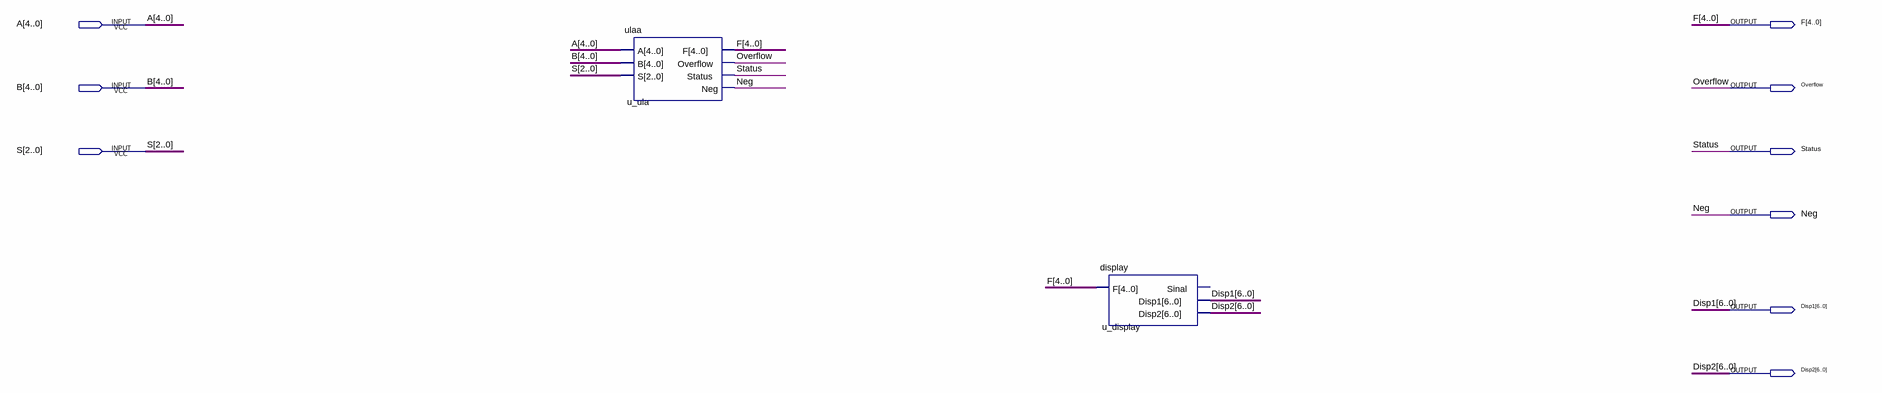
[diagram p0: schematic sheet]
// Quartus schematic ula_display.bdf as structural Verilog: 2 symbols, 9 pins
module ula_display (
  input  [4:0] A,
  input  [4:0] B,
  input  [2:0] S,
  output [4:0] F,
  output Overflow,
  output Status,
  output Neg,
  output [6:0] Disp1,
  output [6:0] Disp2
);

  ulaa u_ula (.A(A), .B(B), .S(S), .F(F), .Overflow(Overflow), .Status(Status), .Neg(Neg));
  display u_display (.F(F), .Disp1(Disp1), .Disp2(Disp2));  // open: Sinal
endmodule
